# EAGLE design ConstantCurrentTester (EAGLE 9.5.2)
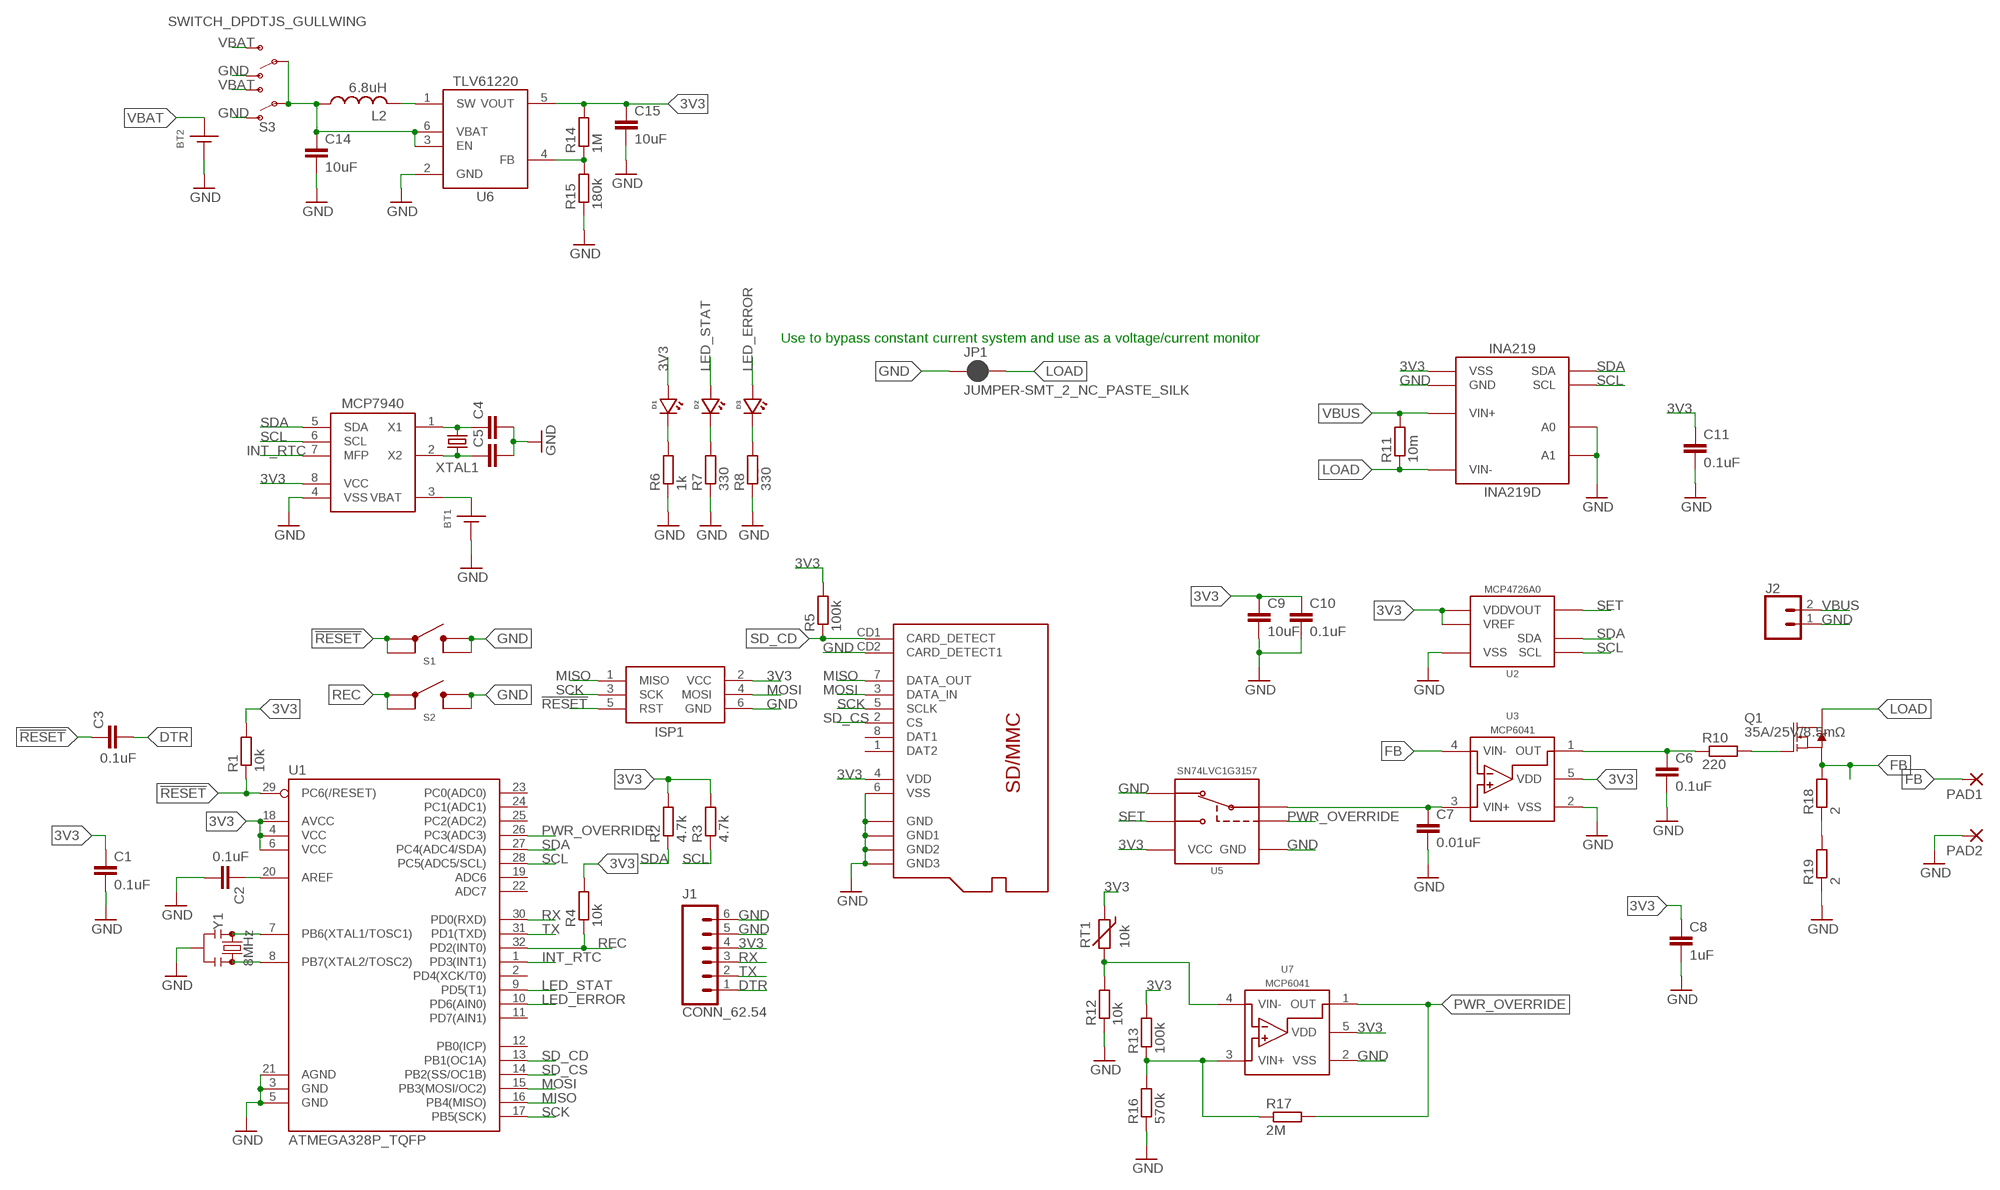
[diagram p0: schematic, sheet 1]

## Parts
BT1  BATTERY_COIN12MM  [LINX_BAT-HLD-012-SMT]
BT2  BATTERY_COINAA  [BK-53]
C1  0.1uF  C-EU0.1UFC0603  [C0603]
C2  0.1uF  C-EU0.1UFC0603  [C0603]
C3  0.1uF  C-EU0.1UFC0603  [C0603]
C4  C-EUC0603  [C0603]
C5  C-EUC0603  [C0603]
C6  0.1uF  C-EU0.1UFC0603  [C0603]
C7  0.01uF  C-EUC0603  [C0603]
C8  1uF  C-EU1UFC0603  [C0603]
C9  10uF  C-EU10UFC0805  [C0805]
C10  0.1uF  C-EU0.1UFC0603  [C0603]
C11  0.1uF  C-EU0.1UFC0603  [C0603]
C14  10uF  C-EU10UFC0805  [C0805]
C15  10uF  C-EU10UFC0805  [C0805]
D1  LEDBLUE0603  [LED_0603]
D2  LEDGREEN0603  [LED_0603]
D3  LEDRED0603  [LED_0603]
ISP1  AVRISP-6  [AVRISP]
J1  CONN_62.54  [1X06]
J2  CONN_023.5MM  [SCREWTERMINAL-3.5MM-2]
JP1  JUMPER-SMT_2_NC_PASTE_SILK  [SMT-JUMPER_2_NC_PASTE_SILK]
L2  6.8uH  INDUCTOR1008  [1008]
PAD1  3,81/1,4  [3,81/1,4]
PAD2  3,81/1,4  [3,81/1,4]
Q1  35A/25V/8.5mΩ  MOSFET-NCH-FDD8780  [DPAK]
R1  10k  R-EU_10KR0603  [R0603]
R2  4.7k  R-EU_4.7KR0603  [R0603]
R3  4.7k  R-EU_4.7KR0603  [R0603]
R4  10k  R-EU_10KR0603  [R0603]
R5  100k  R-EU_100KR0603  [R0603]
R6  1k  R-EU_1KR0603  [R0603]
R7  330  R-EU_330R0603  [R0603]
R8  330  R-EU_330R0603  [R0603]
R10  220  R-EU_220R0603  [R0603]
R11  10m  R-EU_0.01R0805  [R0805]
R12  10k  R-EU_10KR0603  [R0603]
R13  100k  R-EU_100KR0603  [R0603]
R14  1M  R-EU_1MR0603  [R0603]
R15  180k  R-EU_180KR0603  [R0603]
R16  570k  R-EU_R0603  [R0603]
R17  2M  R-EU_R0603  [R0603]
R18  2  R-EU_R2512  [R2512]
R19  2  R-EU_R2512  [R2512]
RT1  10k  THERMISTOR10K  [R0603]
S1  BUTTON6X6_TH  [SWITCH_6MM_TH]
S2  BUTTON6X6_TH  [SWITCH_6MM_TH]
S3  SWITCH_DPDTJS_GULLWING  [JS202011SCQN]
U1  ATMEGA328P_TQFP  ATMEGA328PTQFP_32  [TQFP32-08]
U2  MCP4726A0SOT-23  [SOT23-6L]
U3  MCP6041  [SOT23-5]
U4  INA219D  [SOIC_8]
U5  SN74LVC1G3157SC70  [DCK_R-PDSO-G6]
U6  TLV61220DBV  [DBV_R-PDSO-G6]
U7  MCP6041  [SOT23-5]
U$1  MICRO_SD  [CUSTOM-PARTS_SD_MICRO]
U$2  MCP7940SOIC  [SO08]
XTAL1  CRYSTAL3.2X1.5  [CRYSTAL_3.2X1.5_2-SMD]
Y1  8MHz  RESONATOR8MHZSMD_3.2X1.3  [RESONATOR-SMD-3.2X1.3]

## Nets
3V3: C1.1 C8.1 C9.1 C10.1 C11.1 C15.1 D1.ANODE ISP1.2(VCC) J1.4 R1.2 R2.2 R3.2 R4.2 R5.2 R13.2 R14.2 RT1.1 U1.4(VCC) U1.6(VCC) U1.18(AVCC) U2.3(VDD) U2.6(VREF) U3.5(VDD) U4.5(VSS) U5.5(VCC) U6.5(VOUT) U7.5(VDD) U$1.4(VDD) U$2.8(VCC)
!RESET: C3.1 ISP1.5(RST) R1.1 S1.1 S1.2 U1.29(PC6(/RESET))
DRIVE: Q1.1(G) R10.2
DTR: C3.2 J1.1
FB: PAD1.1(P) Q1.3(S) R18.2 U3.4(VIN-)
FB2: R14.1 R15.2 U6.4(FB)
GND: BT1.GND(-) BT2.NEG@1(-) BT2.NEG@2(-) C1.2 C2.2 C4.2 C5.2 C6.2 C7.2 C8.2 C9.2 C10.2 C11.2 C14.2 C15.2 ISP1.6(GND) J1.5 J1.6 J2.1 JP1.1 PAD2.1(P) R6.1 R7.1 R8.1 R12.1 R15.1 R16.1 R19.1 S1.3 S1.4 S2.3 S2.4 S3.1(O1) S3.6(O2) U1.3(GND) U1.5(GND) U1.21(AGND) U2.2(VSS) U3.2(VSS) U4.1(A1) U4.2(A0) U4.6(GND) U5.2(GND) U5.3(B1) U6.2(GND) U7.2(VSS) U$1.6(VSS) U$1.CD2(CARD_DETECT1) U$1.GND@1(GND) U$1.GND@2(GND1) U$1.GND@3(GND2) U$1.GND@5(GND3) U$2.4(VSS) Y1.2
INT_RTC: U1.1(PD3(INT1)) U$2.7(MFP)
LED_ERROR: D3.ANODE U1.10(PD6(AIN0))
LED_STAT: D2.ANODE U1.9(PD5(T1))
LOAD: JP1.2 Q1.4(D) R11.1 U4.7(VIN-)
MISO: ISP1.1(MISO) U1.16(PB4(MISO)) U$1.7(DATA_OUT)
MOSI: ISP1.4(MOSI) U1.15(PB3(MOSI/OC2)) U$1.3(DATA_IN)
N$1: U1.7(PB6(XTAL1/TOSC1)) Y1.1
N$2: U1.8(PB7(XTAL2/TOSC2)) Y1.3
N$3: C2.1 U1.20(AREF)
N$5: C4.1 U$2.1(X1) XTAL1.P$1
N$6: C5.1 U$2.2(X2) XTAL1.P$2
N$7: D1.CATHODE R6.2
N$8: D2.CATHODE R7.2
N$9: D3.CATHODE R8.2
N$10: C6.1 R10.1 U3.1(OUT)
N$11: R12.2 RT1.2 U7.4(VIN-)
N$12: R13.1 R16.2 R17.1 U7.3(VIN+)
N$13: R18.1 R19.2
PWR_OVERRIDE: R17.2 U1.26(PC3(ADC3)) U5.6(S) U7.1(OUT)
REC: R4.1 S2.1 S2.2 U1.32(PD2(INT0))
RX: J1.3 U1.30(PD0(RXD))
SCK: ISP1.3(SCK) U1.17(PB5(SCK)) U$1.5(SCLK)
SCL: R3.1 U1.28(PC5(ADC5/SCL)) U2.5(SCL) U4.4(SCL) U$2.6(SCL)
SD_CD: R5.1 U1.13(PB1(OC1A)) U$1.CD1(CARD_DETECT)
SD_CS: U1.14(PB2(SS/OC1B)) U$1.2(CS)
SDA: R2.1 U1.27(PC4(ADC4/SDA)) U2.4(SDA) U4.3(SDA) U$2.5(SDA)
SET: C7.1 U2.1(VOUT) U3.3(VIN+) U5.1(B2) U5.4(A)
SW1: L2.2 U6.1(SW)
TX: J1.2 U1.31(PD1(TXD))
V_BACKUP: BT1.POWER0(+) BT1.POWER1(+) U$2.3(VBAT)
VBAT: BT2.POS@1(+) BT2.POS@2(+) S3.3(S1) S3.4(S2)
VBUS: J2.2 R11.2 U4.8(VIN+)
VIN: C14.1 L2.1 S3.2(P1) S3.5(P2) U6.3(EN) U6.6(VBAT)
Unconnected: U1.2(PD4(XCK/T0)) U1.11(PD7(AIN1)) U1.12(PB0(ICP)) U1.19(ADC6) U1.22(ADC7) U1.23(PC0(ADC0)) U1.24(PC1(ADC1)) U1.25(PC2(ADC2)) U$1.1(DAT2) U$1.8(DAT1)

## Notes on the sheet
- Use to bypass constant current system and use as a voltage/current monitor

## Library data of the parts
BT1 = bschulz:BATTERY_COIN: Coin Cell Battery Holder; DIGIKEY: BAT-HLD-012-SMT-ND; MF: Linx; MPN: BAT-HLD-012-SMT
BT2 = bschulz:BATTERY_COIN: Coin Cell Battery Holder
C1-C3 C6 C10 C11 = bschulz_passives:C-EU: CAPACITOR, European symbol; DIGIKEY: 490-6051-1-ND; MF: Murata; MPN: GCM188R71E104KA57D
C4 C5 C7 = bschulz_passives:C-EU: CAPACITOR, European symbol
C8 = bschulz_passives:C-EU: CAPACITOR, European symbol; DIGIKEY: 587-1251-1-ND; MF: Yaiyo Yuden; MPN: EMK107BJ105KA-T
C9 C14 C15 = bschulz_passives:C-EU: CAPACITOR, European symbol; DIGIKEY: 490-6473-6-ND; MF: Murata; MPN: GRM21BR61C106KE15K
D1 = bschulz:LED: Genaric LED; DIGIKEY: 732-4966-1-ND; MF: Wurth; MPN: 150060BS75000
D2 = bschulz:LED: Genaric LED; DIGIKEY: 732-4971-1-ND; MF: Wurth; MPN: 150060GS75000
D3 = bschulz:LED: Genaric LED; DIGIKEY: 732-4978-1-ND; MF: Wurth; MPN: 150060RS75000
ISP1 = bschulz:AVRISP: AVR ISP HEADER Standard 6 pin header for AVR programming
J1 = bschulz:CONN_6: Genaric 6 terminal header Digikey 2.54_SCREW
J2 = bschulz:CONN_02: Genaric 2 terminal header SCREW_2.54 39532_RA; DIGIKEY: ED2635-ND; MF: On Shore Technology; MPN: OSTTE020161; PROD_ID: CONN-08399
JP1 = SparkFun-Jumpers:JUMPER-SMT_2_NC_PASTE: Normally closed solder jumper This jumper has an aperture in the stencil to allow solder paste to bridge the split in the wire so it's normally closed (NC). Wick off the solder to open the connection. Reapply solder to reclose the connection.
L2 = bschulz:INDUCTOR: Genaric inductor; DIGIKEY: 732-4849-1-ND; MF: Wurth; MPN: 74438323068
PAD1 PAD2 = wirepad:3,81/1,4: THROUGH-HOLE PAD
Q1 = bschulz:MOSFET-NCH: N-channel MOSFETs Voltage controlled devices that allow control of high current outputs. SparkFun Products: SparkFun OpenScale <https://www.sparkfun.com/products/13261> SparkFun Digital Sandbox <https://www.sparkfun.com/products/12651> SparkFun Monster Moto Shield <https://www.sparkfun.com/products/10182> SparkFun MOSFET Power Controller <https://www.sparkfun.com/products/11214>; PROD_ID: TRANS-09984
R1 R4 = bschulz:R-EU_: RESISTOR, European symbol Digikey Parts: Yageo, 0402 Yageo, 0603 Panasonic, 0603 Panasonic, precision, 0603 Panasonic, 0805 Rohm, current sense Vishay, pulse proof automotive; DIGIKEY: 311-10.0KHRCT-ND; MF: Yageo; MPN: RC0603FR-0710KL; VALUE_PART: 10k
R2 R3 = bschulz_passives:R-EU_: RESISTOR, European symbol Digikey Parts: Yageo, 0402 Yageo, 0603 Panasonic, 0603 Panasonic, precision, 0603 Panasonic, 0805 Rohm, current sense Vishay, pulse proof automotive; DIGIKEY: 311-4.70KHRCT-ND; MF: Yageo; MPN: RC0603FR-074K7L; VALUE_PART: 4.7k
R5 R13 = bschulz_passives:R-EU_: RESISTOR, European symbol Digikey Parts: Yageo, 0402 Yageo, 0603 Panasonic, 0603 Panasonic, precision, 0603 Panasonic, 0805 Rohm, current sense Vishay, pulse proof automotive; DIGIKEY: RC0402FR-071ML; MF: Yageo; MPN: RC0603FR-07100KL; VALUE_PART: 100k
R6 = bschulz_passives:R-EU_: RESISTOR, European symbol Digikey Parts: Yageo, 0402 Yageo, 0603 Panasonic, 0603 Panasonic, precision, 0603 Panasonic, 0805 Rohm, current sense Vishay, pulse proof automotive; DIGIKEY: 311-1KLDCT-ND; MF: Yageo; MPN: AC0603FR-071KL; VALUE_PART: 1k
R7 R8 = bschulz_passives:R-EU_: RESISTOR, European symbol Digikey Parts: Yageo, 0402 Yageo, 0603 Panasonic, 0603 Panasonic, precision, 0603 Panasonic, 0805 Rohm, current sense Vishay, pulse proof automotive; DIGIKEY: 311-330HRCT-ND; MF: Yageo; MPN: RC0603FR-07330RL; VALUE_PART: 330
R10 = bschulz_passives:R-EU_: RESISTOR, European symbol Digikey Parts: Yageo, 0402 Yageo, 0603 Panasonic, 0603 Panasonic, precision, 0603 Panasonic, 0805 Rohm, current sense Vishay, pulse proof automotive; DIGIKEY: 311-220HRCT-ND; MF: Yageo; MPN: RC0603FR-07220RL; VALUE_PART: 220
R11 = bschulz_passives:R-EU_: RESISTOR, European symbol Digikey Parts: Yageo, 0402 Yageo, 0603 Panasonic, 0603 Panasonic, precision, 0603 Panasonic, 0805 Rohm, current sense Vishay, pulse proof automotive; DIGIKEY: CRF0805-FZ-R010ELFCT-ND; MF: Bourns; MPN: CRF0805-FZ-R010ELF
R12 = bschulz_passives:R-EU_: RESISTOR, European symbol Digikey Parts: Yageo, 0402 Yageo, 0603 Panasonic, 0603 Panasonic, precision, 0603 Panasonic, 0805 Rohm, current sense Vishay, pulse proof automotive; DIGIKEY: 311-10.0KHRCT-ND; MF: Yageo; MPN: RC0603FR-0710KL; VALUE_PART: 10k
R14 = bschulz_passives:R-EU_: RESISTOR, European symbol Digikey Parts: Yageo, 0402 Yageo, 0603 Panasonic, 0603 Panasonic, precision, 0603 Panasonic, 0805 Rohm, current sense Vishay, pulse proof automotive; DIGIKEY: P1.00MHCT-ND; MF: Panasonic; MPN: ERJ-3EKF1004V; VALUE_PART: 1M
R15 = bschulz_passives:R-EU_: RESISTOR, European symbol Digikey Parts: Yageo, 0402 Yageo, 0603 Panasonic, 0603 Panasonic, precision, 0603 Panasonic, 0805 Rohm, current sense Vishay, pulse proof automotive; DIGIKEY: P180KHCT-ND; MF: Panasonic; MPN: ERJ-3EKF1803V; VALUE_PART: 180k
R16 R17 = bschulz_passives:R-EU_: RESISTOR, European symbol Digikey Parts: Yageo, 0402 Yageo, 0603 Panasonic, 0603 Panasonic, precision, 0603 Panasonic, 0805 Rohm, current sense Vishay, pulse proof automotive; MF: Yageo
R18 R19 = bschulz_passives:R-EU_: RESISTOR, European symbol Digikey Parts: Yageo, 0402 Yageo, 0603 Panasonic, 0603 Panasonic, precision, 0603 Panasonic, 0805 Rohm, current sense Vishay, pulse proof automotive
RT1 = bschulz:THERMISTOR: Thermistor NTC Thermistors: Digikey = 490-12101-1-ND, R25 = 47K, Package = 0603 Digikey = 490-16279-1-ND, R25 = 10K, Package = 0603; DIGIKEY: P12011CT-ND; MF: Panasonic; MPN: ERT-J1VG103FA
S1 S2 = bschulz:BUTTON: Genaric SPST Pushbutton; DIGIKEY: 450-1650-ND; MF: TE Connectivity; MPN: 1825910-6
S3 = bschulz:SWITCH_DPDT: Genric DPDT Switch; DIGIKEY: 401-2002-1-ND; MF: C&K; MPN: JS202011SCQN
U1 = bschulz:ATMEGA328P: Popular 328P in QFP Storefront component: ATmega328 - TQFP (COM-13448) Datasheet SparkFun Products SparkFun RedBoard - Programmed with Arduino (DEV-12757) Arduino Pro Mini 328 - 5V/16MHz (DEV-11113) Arduino Pro Mini 328 - 3.3V/8MHz (DEV-11114) SparkFun OpenLog (DEV-13712) SparkFun MicroView - OLED Arduino Module (DEV-12923) SparkFun Digital Sandbox (DEV-12651) SparkFun PicoBoard (WIG-11888) Arduino Fio (DEV-10116) LilyPad Arduino 328 Main Board (DEV-13342) SparkFun RedStick (DEV-13741) LilyPad MP3 (DEV-11013) LilyPad Arduino SimpleSnap (DEV-10941) SparkFun Stepoko (ROB-13899) SparkFun Geiger Counter (SEN-11345) SparkFun EL Sequencer (COM-12781) Arduino Pro 328 - 5V/16MHz (DEV-10915) CryptoCape (DEV-12773) SparkFun IR Thermometer Evaluation Board - MLX90614 (SEN-10740) SparkFun RedBot Mainboard (ROB-12097) Arduino Pro 328 - 3.3V/8MHz (DEV-10914) SparkFun Block for Intel® Edison - Arduino (DEV-13036) SparkFun Simon Says - Surface Mount Soldering Kit (KIT-10935) SparkFun 7-Segment Serial Display - Red (COM-11441) SparkFun 7-Segment Serial Display - White (COM-11629) SparkFun 7-Segment Serial Display - Yellow (COM-11443) SparkFun 7-Segment Serial Display - Kelly Green (COM-11440) SparkFun 7-Segment Serial Display - Blue (COM-11442) SparkFun OpenSegment Serial Display - 20mm (Blue) (COM-11647) SparkFun OpenSegment Serial Display - 20mm (Green) (COM-11646) SparkFun OpenSegment Serial Display - 20mm (White) (COM-11648) SparkFun OpenSegment Serial Display - 20mm (Red) (COM-11644) SparkFun OpenSegment Serial Display - 20mm (Yellow) (COM-11645) SparkFun OpenSegment Shield (DEV-13190); DIGIKEY: ATMEGA328PB-AURCT-ND; MF: Atmel; MPN: ATMEGA328PB-AUR; PROD_ID: IC-09069
U2 = bschulz:MCP4726*: MCP4726x - 8/10/12 Bit Digital to Analog Converter Characteristics: VCC: 2.7~5.5V IQ: 210μA (On), 60nA (Shutdown) Operating Temperature: -40°C to 125°C Number of Outputs: 1 Settling Time: 6μs Number of Bits: 8 (MCP4706), 10 (MCP4716), 12 (MCP4726) Digikey: MCP4726A0T-E/CHCT-ND (MCP4726, A0) <https://www.digikey.com/product-detail/en/microchip-technology/MCP4726A0T-E-CH/MCP4726A0T-E-CHCT-ND/2713266> MCP4726A1T-E/CHCT-ND (MCP4726, A1) <https://www.digikey.com/product-detail/en/microchip-technology/MCP4726A1T-E-CH/MCP4726A1T-E-CHCT-ND/5148848> MCP4726A2T-E/CHCT-ND (MCP4726, A2) <https://www.digikey.com/product-detail/en/microchip-technology/MCP4726A2T-E-CH/MCP4726A2T-E-CHCT-ND/8638162> MCP4726A3T-E/CHCT-ND (MCP4726, A3) <https://www.digikey.com/product-detail/en/microchip-technology/MCP4726A3T-E-CH/MCP4726A3T-E-CHCT-ND/7065582>; DIGIKEY: MCP4726A0T-E/CHCT-ND; DISP: MCP4726A0; MF: Microchip; MPN: MCP4726A0T-E/CH
U3 U7 = bschulz:MCP6041: MCP6041 - Low Power Rail to Rail Op-Amp Characteristics: Vs: 1.4V ~ 6V Iq: 600nA Common Mode Range: 0V ~ 6V GBP: 14 kHz Operating Temperature: -40°C to 125°C Digikey: MCP6041T-I/OTCT-ND; DIGIKEY: MCP6041T-I/OTCT-ND; DISP: MCP6041; MF: Microchip; MPN: MCP6041T-I/OT
U4 = bschulz:INA219: INA219 - Zero Drift Bidirectional Current/Power Monitor with I2C Interface Characteristics: Vcc: 3V ~ 5.5V Iq: 700uA Common Mode Range: 0V ~ 26V Operating Temperature: -40°C to 125°C Digikey: SOIC (D) SOT-23 (DCN); DIGIKEY: 296-23978-1-ND; MF: TI; MPN: INA219AIDR
U5 = bschulz:SN74LVC1G3157: SN74LVC1G3157 - SPDT Analog Switch Characteristics: VCC: 1.65~5.5V Operating Temperature: -40°C to 85°C On state resistace: 15 Ω, Max Channel to Channel Matching: 0.1 Ω, Typical Digikey: 296-14909-1-ND (SC70, DCK) <https://www.digikey.com/product-detail/en/texas-instruments/SN74LVC1G3157DCKR/296-14909-1-ND/562526> 296-18015-1-ND (SOT-666, DRL) <https://www.digikey.com/product-detail/en/texas-instruments/SN74LVC1G3157DRLR/296-18015-1-ND/770530>; DIGIKEY: 296-14909-1-ND; DISP: SN74LVC1G3157; MF: TI; MPN: SN74LVC1G3157DCKR
U6 = bschulz:TLV61220: TLV61220 - Low-Input Voltage Step-Up Converter (Boost) Characteristics: Vin: 0.7V ~ 5.5V Vout: 1.8V ~ 5.5V Output Current (Max): 400 mA IQ: 5μA Operating Temperature: -40°C to 85°C Digikey: 296-30547-1-ND <https://www.digikey.com/product-detail/en/texas-instruments/TLV61220DBVR/296-30547-1-ND/3458120>; DIGIKEY: 296-30547-1-ND; MF: TI; MPN: TLV61220DBVR
U$1 = bschulz:MICRO_SD: Micro SD card holder, Push-Pull, Exposed leads for easy (non-reflow) soldering PN: HR1941CT-ND
U$2 = bschulz:MCP7940: MCP7940 - RTC Characteristics: VCC: 1.8~5.5V VBat: 1.3~5.5V Memory: 64B Interface: I2C Operating Temperature: -40°C to 85°C Digikey: MCP7940N-I/SN-ND Pin Compatible Alternatives Note: These are recomendations at the time, always verify pin compatability using combination of Mrk1 EyeBall and quality datasheet; DIGIKEY: MCP7940N-I/SN-ND; MF: Microchip; MPN: MCP7940N-I/SN
XTAL1 = bschulz:CRYSTAL: Crystal Oscilator 2 Pin quartz crystal oscilators Variants 3.2x1.5mm (Only available in 32.768kHz) <https://www.digikey.com/products/en/crystals-oscillators-resonators/crystals/171?FV=b839bf%2Cb83a33%2C8640001%2C864000f%2C8640003%2C1f140000%2Cmu32.768kHz%7C2150%2Cffe000ab&quantity=10&ColumnSort=1000011&page=1&stock=1&k=crystal&pageSize=25&pkeyword=crystal> 5 x 3.2mm (8MHz ~ 50MHz) <https://www.digikey.com/products/en/crystals-oscillators-resonators/crystals/171?FV=402f3e%2Cb8434d%2C1f140000%2Cffe000ab&quantity=10&ColumnSort=1000011&page=1&stock=1&pageSize=25>
Y1 = bschulz:RESONATOR: 16MHz Resonator Digikey Example <http://www.digikey.com/product-detail/en/murata-electronics-north-america/CSTCE16M0V53-R0/490-1198-1-ND/584635> Frequency: 16MHz Frequency Stability: ±0.3% Frequency Tolerance: ±0.5% Capacitance: 15pF SparkFun Products SparkFun OpenLog <https://www.sparkfun.com/products/13712> SparkFun MicroView - OLED Arduino Module <https://www.sparkfun.com/products/12923>; DIGIKEY: 490-17960-1-ND; MF: Murata; MPN: CSTNE8M00G55Z000R0

## Board
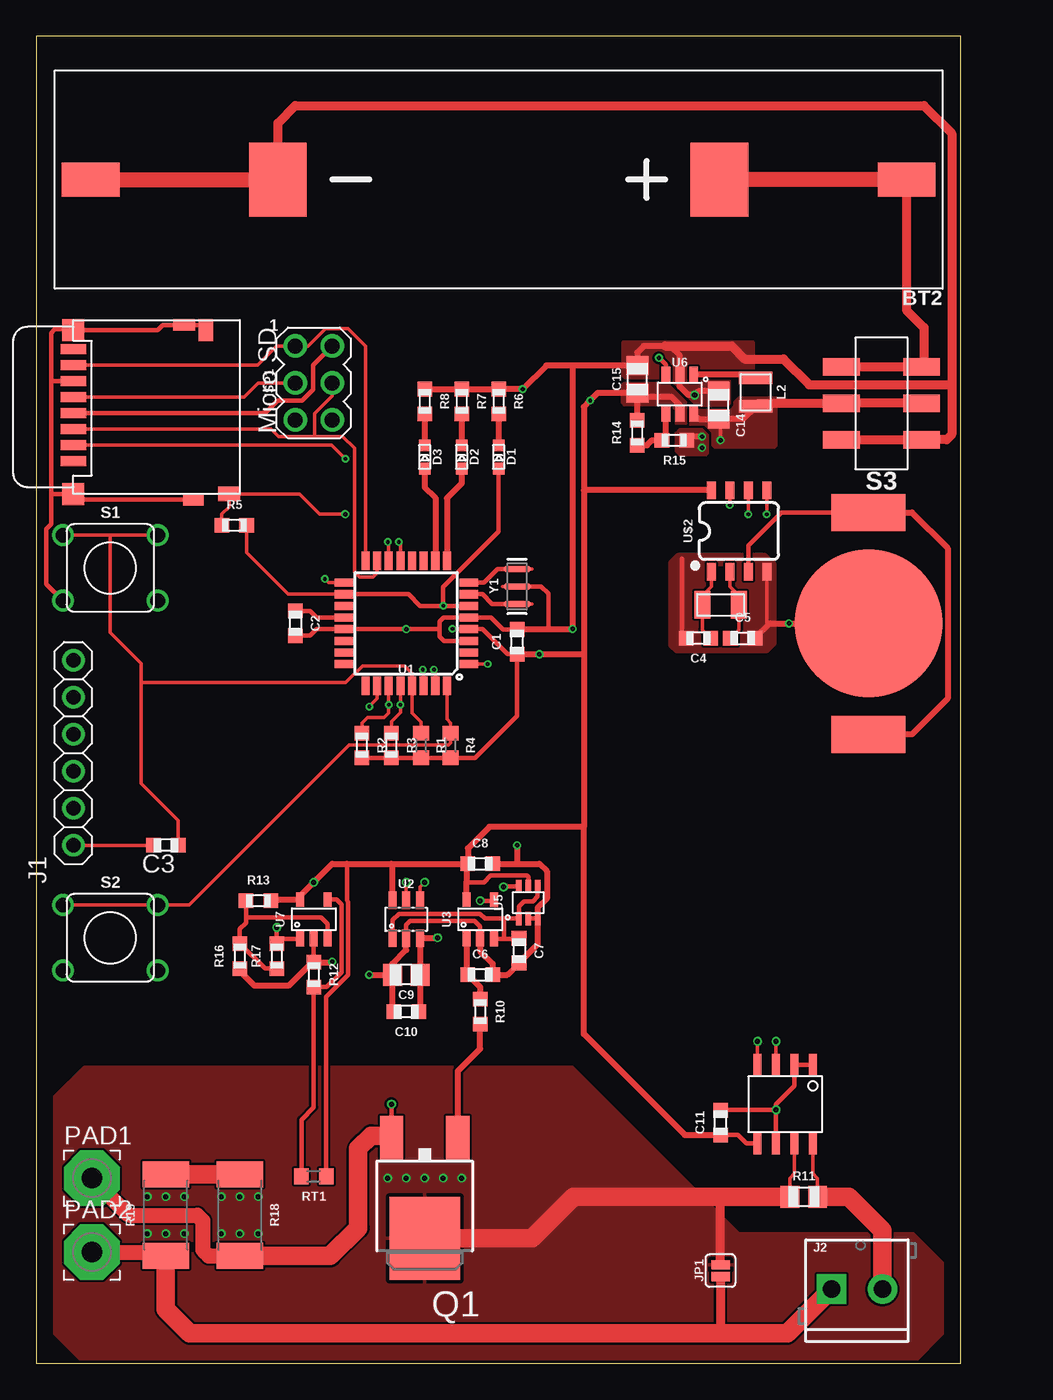
[diagram p1: board, top side]
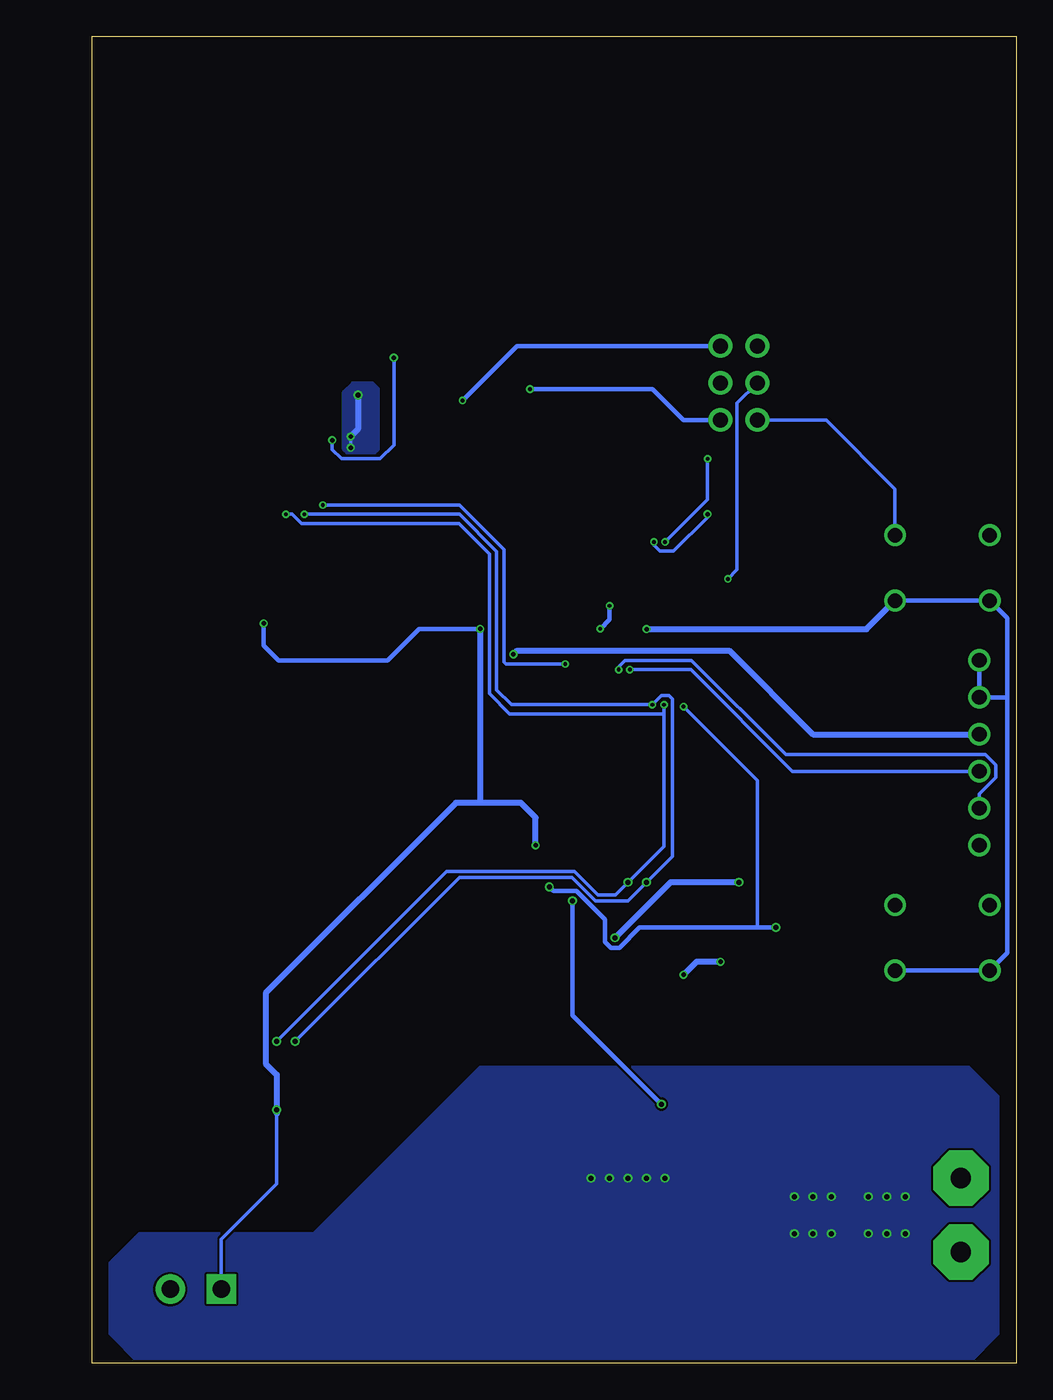
[diagram p2: board, bottom side, seen from below]

Size 63.48 x 91.11 mm. Coordinates in mm from the lower left corner, seen from the top.
Outline: 0,0 63.48,0 63.48,91.11 0,91.11 0,0
Copper layers (1*16): Top 0.035559375mm / dielectric 1.6mm / Bottom 0.035559375mm
Design rules "jlcpcb2layer *": minimum track width 5mil, minimum drill 0.2mm, track to track 6mil, track to pad 6mil, pad to pad 6mil, via to via 6mil, smd to smd 6mil, copper to edge 8mil, drill to drill 6mil, minimum pad ring 5mil, minimum via ring 5mil, stop-mask expansion 2.5mil, vias tented up to drill 0mil, thermal gap 10mil

### Footprints (pad centres in the part's own frame; a part is rotated, then mirrored left to right if it is on the bottom)
LINX_BAT-HLD-012-SMT = smd 10.16 x 10.16: GND 0,0 | smd 2.54 x 5.08: POWER0 -7.62,0; POWER1 7.62,0
BK-53 = smd 3.96 x 2.34: NEG@1 28.015,0; POS@1 -28.015,0 | smd 3.96 x 5.08: NEG@2 15.165,0; POS@2 -15.165,0
C0603 = smd 1 x 1: 1 -0.85,0; 2 0.85,0
C0805 = smd 1.3 x 1.5: 1 -0.95,0; 2 0.95,0
LED_0603 = smd 0.8 x 0.8: ANODE 0.8,0; CATHODE -0.8,0
AVRISP = drill 1.02 pad 1.626: 1 -1.27,2.54; 2 1.27,2.54; 3 -1.27,0; 4 1.27,0; 5 -1.27,-2.54; 6 1.27,-2.54
1X06 = drill 1.016: 1 -6.35,0; 2 -3.81,0; 3 -1.27,0; 4 1.27,0; 5 3.81,0; 6 6.35,0
SCREWTERMINAL-3.5MM-2 = drill 1.2 pad 2.032 square: 1 0,0 | drill 1.2 pad 2.032: 2 3.5,0
SMT-JUMPER_2_NC_PASTE_SILK = smd 0.635 x 1.27: 1 -0.406,0; 2 0.406,0
1008 = smd 0.85 x 2.3: 1 -0.975,0; 2 0.975,0
3,81/1,4 = drill 1.397 pad 3.81 octagon: 1 0,0
DPAK = smd 1.6 x 3: 1 -2.28,-5.31; 3 2.28,-5.31 | smd 4.826 x 5.715: 4 0,1.588
R0603 = smd 1 x 1.1: 1 -0.85,0; 2 0.85,0
R0603' = smd 1 x 1: 1 -0.85,0; 2 0.85,0
R0805 = smd 1.3 x 1.5: 1 -0.95,0; 2 0.95,0
R2512 = smd 1.8 x 3.2: 1 -2.8,0; 2 2.8,0
SWITCH_6MM_TH = drill 1: 1 -3.25,2.25; 2 3.25,2.25; 3 -3.25,-2.25; 4 3.25,-2.25
JS202011SCQN = smd 1.2 x 2.515: 1 -2.5,-2.75; 2 0,-2.75; 3 2.5,-2.75; 4 2.5,2.75; 5 0,2.75; 6 -2.5,2.75
TQFP32-08 = smd 1.27 x 0.559: 1 -4.293,2.8; 2 -4.293,2; 3 -4.293,1.2; 4 -4.293,0.4; 5 -4.293,-0.4; 6 -4.293,-1.2; 7 -4.293,-2; 8 -4.293,-2.8; 17 4.293,-2.8; 18 4.293,-2; 19 4.293,-1.2; 20 4.293,-0.4; 21 4.293,0.4; 22 4.293,1.2; 23 4.293,2; 24 4.293,2.8 | smd 0.559 x 1.27: 9 -2.8,-4.293; 10 -2,-4.293; 11 -1.2,-4.293; 12 -0.4,-4.293; 13 0.4,-4.293; 14 1.2,-4.293; 15 2,-4.293; 16 2.8,-4.293; 25 2.8,4.293; 26 2,4.293; 27 1.2,4.293; 28 0.4,4.293; 29 -0.4,4.293; 30 -1.2,4.293; 31 -2,4.293; 32 -2.8,4.293
SOT23-6L = smd 0.55 x 1.2: 1 -0.95,-1.3; 2 0,-1.3; 3 0.95,-1.3; 4 0.95,1.3; 5 0,1.3; 6 -0.95,1.3
SOT23-5 = smd 0.55 x 1: 1 -0.95,-1.35; 2 0,-1.35; 3 0.95,-1.35; 4 0.95,1.35; 5 -0.95,1.35
SOIC_8 = smd 0.55 x 1.5: 1 -2.54,-2.7; 2 -1.27,-2.7; 3 0,-2.7; 4 1.27,-2.7; 5 1.27,2.7; 6 0,2.7; 7 -1.27,2.7; 8 -2.54,2.7
DCK_R-PDSO-G6 = smd 0.4 x 0.9: 1 -0.65,-1.1; 2 0,-1.1; 3 0.65,-1.1; 4 0.65,1.1; 5 0,1.1; 6 -0.65,1.1
DBV_R-PDSO-G6 = smd 0.6 x 1.05: 1 -0.95,-1.35; 2 0,-1.35; 3 0.95,-1.35; 4 0.95,1.35; 5 0,1.35; 6 -0.95,1.35
CUSTOM-PARTS_SD_MICRO = smd 0.7 x 1.75: 1 -2.25,0; 2 -3.35,0; 3 -4.45,0; 4 -5.55,0; 5 -6.65,0; 6 -7.75,0; 7 -8.85,0; 8 -9.95,0 | smd 1 x 1.5: CD1 0,10.7 | smd 1.5 x 1: CD2 -11.25,9.1 | smd 1.5 x 1.5: GND@1 0,0; GND@2 -11.25,0 | smd 0.8 x 1.5: GND@3 -11.6,7.6 | smd 0.8 x 1.4: GND@5 0.4,8.25
SO08 = smd 0.6 x 1.2: 1 -1.905,-2.8; 2 -0.635,-2.8; 3 0.635,-2.8; 4 1.905,-2.8; 5 1.905,2.8; 6 0.635,2.8; 7 -0.635,2.8; 8 -1.905,2.8
CRYSTAL_3.2X1.5_2-SMD = smd 1.1 x 1.9: P$1 -1.25,0; P$2 1.25,0
RESONATOR-SMD-3.2X1.3 = smd 0.45 x 1.905: 1 -1.2,0; 2 0,0; 3 1.2,0

### Placement (x,y rotation side)
BT1  57.15,50.8 90 top
BT2  31.75,81.28 180 top
C1  33.02,49.53 90 top
C2  17.78,50.8 270 top
C3  8.89,35.56 180 top
C4  45.47,49.78 180 top
C5  48.51,49.78 0 top
C6  30.48,26.67 0 top
C7  33.15,28.32 270 top
C8  30.48,34.29 0 top
C9  25.4,26.67 180 top
C10  25.4,24.13 180 top
C11  46.99,16.51 90 top
C14  46.86,65.79 90 top
C15  41.27,67.56 90 top
D1  31.75,62.23 270 top
D2  29.21,62.23 270 top
D3  26.67,62.23 270 top
ISP1  19.05,67.31 0 top
J1  2.54,41.91 90 top
J2  54.61,5.08 0 top
JP1  46.99,6.35 90 top
L2  49.4,66.67 90 top
PAD1  3.81,12.7 0 top
PAD2  3.81,7.62 0 top
Q1  26.67,10.16 180 top
R1  26.42,42.42 270 top
R2  4.7k  [R0603']  22.35,42.42 270 top
R3  4.7k  [R0603']  24.38,42.42 270 top
R4  28.45,42.42 270 top
R5  100k  [R0603']  13.59,57.53 0 top
R6  1k  [R0603']  31.75,66.04 270 top
R7  330  [R0603']  29.21,66.04 270 top
R8  330  [R0603']  26.67,66.04 270 top
R10  220  [R0603']  30.48,24.13 270 top
R11  52.7,11.43 0 top
R12  10k  [R0603']  19.05,26.67 270 top
R13  100k  [R0603']  15.24,31.75 0 top
R14  1M  [R0603']  41.27,63.88 90 top
R15  180k  [R0603']  43.81,63.37 180 top
R16  570k  [R0603']  13.97,27.94 90 top
R17  2M  [R0603']  16.51,27.94 90 top
R18  13.97,10.16 270 top
R19  8.89,10.16 90 top
RT1  19.05,12.83 180 top
S1  5.08,54.61 0 top
S2  5.08,29.21 0 top
S3  58.04,65.91 90 top
U1  25.4,50.8 180 top
U2  25.4,30.48 0 top
U3  30.48,30.48 0 top
U4  50.8,17.78 180 top
U5  33.78,31.62 0 top
U6  44.2,66.55 180 top
U7  19.05,30.48 0 top
U$1  2.54,59.69 270 top
U$2  48.26,57.15 0 top
XTAL1  46.99,52.07 0 top
Y1  33.02,53.34 90 top

### Tracks (layer width: path | path; a pad name or v marks a point on that pad's centre or on a via)
3V3  (via drill 0.25 pad 0.13, 0.3 pad 0.13, 0.35)
  Top 0.254: R5.2 14.44,55.66 17.3,52.8 U1.18 | 37.59,48.64 37.55,48.68
  Top 0.305: C11.1 48.19,15.66 48.77,15.08 U4.5 | 29.53,33.02 30.73,33.02 31.2,33.48 33.7,33.48 33.78,33.4 U5.5 | RT1.1 19.9,25.13 21.41,26.65 21.41,31.68 21.34,31.76 21.34,34.29 | R2.2 R3.2 R1.2 R4.2 30.14,41.57 33.02,44.45 C1.1 32.89,48.68 32.35,48.68 30.63,50.4 U1.4 28.59,50.4 v28.57,50.42 | U1.18 25.56,52.8 26.36,52 v27.94,52 | v27.94,52 U1.6 | U$1.4 15.71,65.24 16.56,66.09 18.23,66.09 19,66.86 19,68.53 ISP1.2 | v27.94,52 27.94,53.28 31.75,57.09 D1.ANODE
  Top 0.406: U6.5 44.2,65.79 43.62,66.36 41.53,66.36 C15.1 | R14.2 C15.1 | C15.1 38.55,66.61 v38.04,66.1 37.59,65.66 37.59,59.94 | C10.1 26.35,24.23 C9.1 U2.3 27.53,29.18 v27.56,29.21 | C8.1 29.53,34.19 29.53,33.02 U3.5 | R13.2 16.17,31.83 U7.5 18.1,32.07 v19.05,33.02 20.32,34.29 21.34,34.29 24.38,34.29 | 24.38,34.29 C8.1 | U2.6 24.45,34.22 24.38,34.29 | C11.1 44.54,15.66 37.59,22.61 37.59,36.83 | 37.59,59.94 37.59,48.64 37.59,36.83 | 37.59,36.83 31.11,36.83 29.63,35.34 C8.1 | 32.89,48.68 v34.54,48.68 37.55,48.68 | U$2.8 37.59,59.94
  Bottom 0.305: v28.57,50.42 27.94,51.05 v27.94,52 | ISP1.2 34.29,69.85 v38.04,66.1
  Bottom 0.406: v19.05,33.02 23.75,33.02 v27.56,29.21 | J1.4 13.97,43.18 19.72,48.93 34.29,48.93 v34.54,48.68
  pour Top (rank 2, no thermals): 40.26,67.18 40.39,67.31 43.43,67.31 44.58,66.17 44.58,64.52 43.94,64.52 43.94,65.41 43.56,65.79 40.39,65.79 40.26,65.91
!RESET
  Top 0.254: R1.1 26.42,44.03 25.8,44.65 U1.29 25.8,47.35 25.27,47.88 22.39,47.88 21.24,46.74 7.2,46.74 | S1.1 5.08,56.86 | 5.08,56.86 S1.2 | 7.2,46.74 7.2,46.99 7.2,48.05 5.08,50.16 5.08,56.86 | 7.2,46.74 7.2,39.79 9.74,37.25 C3.1
  Bottom 0.254: S1.2 8.33,60.03 13.06,64.77 ISP1.5
DRIVE
  Top 0.406: Q1.1 28.95,20.06 30.48,21.59 R10.2
DTR
  Top 0.254: C3.2 J1.1
FB  (via drill 0.35)
  Top 0.305: U3.4 31.35,31.75 v30.48,31.75 | v24.38,17.78 v24.39,17.77 24.39,15.62 Q1.3
  Top 1.016: PAD1.1 6.35,10.16 11.05,10.16 11.43,9.78 11.43,7.75 11.82,7.36 R18.2 12.96,7.36
  Top 1.27: R18.2 20.19,7.36 22.1,9.27 22.1,14.73 22.99,15.62 24.39,15.62
  Bottom 0.305: v30.48,31.75 30.48,23.88 v24.38,17.78
FB2
  Top 0.406: R14.1 41.95,63.03 42.29,63.37 R15.2 43.25,63.65 U6.4
GND  (via drill 0.3, 0.3 pad 0.13, 0.35)
  Top 0.254: C5.2 50.16,50.59 U$2.4
  Top 0.305: U5.2 U5.3 | U2.2 25.4,30.1 25.65,30.35 30.1,30.35 30.48,29.97 U3.2 | R12.1 U7.2 | U4.6 v50.8,17.4 | v50.8,17.4 50.8,17.75 52.07,19.02 U4.2 U4.1 | C11.2 47.03,17.4 v50.8,17.4 | C1.2 32.04,50.38 31.22,51.2 U1.5 27.96,51.2 27.69,50.93 27.69,50.42 | Y1.2 34.67,53.34 35.18,52.83 35.18,50.38 | 27.69,50.42 27.69,49.91 28,49.6 U1.3 | 27.69,50.42 27.67,50.4 v25.4,50.4 U1.21 19.25,50.4 18.8,49.95 C2.2 | 1.39,67.44 U$1.6 1.02,67.44 | U$1.CD2 11.29,71.29 U$1.GND@3 8.68,71.29 8.33,70.94 U$1.GND@2 2.49,70.99 1.27,70.99 1.02,70.74 1.02,67.44 | U$1.GND@5 2.94,59.29 U$1.GND@1 1.02,59.69 | S1.3 0.67,53.52 0.67,57.29 1.02,57.63 1.02,59.69 | 1.02,67.44 1.02,59.69 | C4.2 44.32,50.08 44.32,55.24
  Top 0.406: C14.2 45.47,66.74 v45.21,66.48 44.77,66.48 44.2,67.06 U6.2 44.2,69.22 43.56,69.85 43.18,69.85 41.72,69.85 41.27,69.4 C15.2 36.83,68.51 | v45.72,63.63 44.92,63.63 R15.1 | U3.2 30.48,28.28 31.33,27.43 C6.2 32.35,26.67 C7.2 34.43,28.76 U5.3 34.43,31.29 35.05,31.91 35.05,33.78 34.54,34.29 33.02,34.29 | C10.2 24.45,24.23 C9.2 | U2.2 25.4,28.37 24.45,27.42 C9.2 | C8.2 33.02,34.29 | R16.1 13.97,26.92 14.99,25.91 17.31,25.91 18.92,27.52 R12.1 20.28,27.52 v20.32,27.56 | 36.83,68.51 35.02,68.51 v33.4,66.89 R6.1 R7.1 R8.1 | C1.2 35.18,50.38 36.79,50.38 v36.83,50.42 36.83,68.51 | v33.02,35.56 33.02,34.29 | v22.86,26.67 C9.2 | C5.2 50.38,50.8 v51.69,50.8 BT1.GND
  Top 0.61: JP1.1 46.99,2.03 | S3.6 S3.1 62.52,63.41 62.87,63.75 62.87,67.18 | 43.18,69.85 47.75,69.85 48.64,68.96 51.31,68.96 53.09,67.18 62.87,67.18 | BT2.NEG@2 16.59,85.17 17.78,86.36 60.96,86.36 62.87,84.45 62.87,67.18
  Top 1.016: BT2.NEG@1 BT2.NEG@2 17.78,81.28 | PAD2.1 8.63,7.62 R19.1
  Top 1.27: R19.1 8.89,3.68 10.54,2.03 46.99,2.03 51.56,2.03 J2.1
  Bottom 0.203: v45.72,63.63 v45.72,62.87
  Bottom 0.254: v50.8,17.4 50.8,17.14 50.8,12.32 54.61,8.51 J2.1
  Bottom 0.305: 0.64,45.72 0.64,51.16 S1.3 S1.4 | 0.64,45.72 0.64,28.16 S2.3 S2.4 | J1.6 J1.5 0.64,45.72 | ISP1.6 22.86,64.77 24.98,66.89 v33.4,66.89 | v36.83,50.42 41.02,50.42 43.18,48.26 50.67,48.26 51.69,49.28 v51.69,50.8
  Bottom 0.406: v45.21,66.48 45.21,64.14 v45.72,63.63 | v25.4,50.4 10.29,50.4 S1.4 | v20.32,27.56 21.97,27.56 v22.86,26.67 | 50.8,17.14 50.8,19.81 51.56,20.57 51.56,25.41 38.49,38.48 36.7,38.48 | v33.02,35.56 33.02,37.47 34.04,38.48 36.7,38.48 | 36.7,38.48 36.83,38.61 v36.83,50.42
  pour Top (no thermals): 40.26,70.1 40.26,67.82 40.39,67.69 43.43,67.69 45.34,65.79 47.5,65.79 47.62,65.91 47.62,67.44 48.26,68.07 49.28,68.07 49.28,70.1
  pour Top (no thermals): 43.94,63.88 44.2,64.14 45.72,64.14 46.1,63.75 46.1,62.48 45.97,62.36 44.2,62.36 43.94,62.61
  pour Bottom: 46.23,62.74 45.97,62.48 44.07,62.48 43.81,62.74 43.81,66.93 44.2,67.31 45.59,67.31 46.23,66.67
  pour Top (no thermals): 43.56,54.99 43.56,49.28 43.94,48.9 50.16,48.9 50.67,49.4 50.67,54.86 50.04,55.5 48.77,55.5 48.26,54.99 48.26,51.69 48.01,51.44 46.23,51.44 46.1,51.56 46.1,54.99 45.59,55.5 44.07,55.5
  pour Top (no thermals): 45.34,55.5 49.28,55.5 49.4,55.37 49.53,55.24 49.53,53.21 47.88,53.21 47.75,53.34 47.75,53.59 47.62,53.72 47.62,54.61 47.37,54.86 47.24,54.86 46.1,54.86 45.34,54.86
INT_RTC  (via drill 0.25 pad 0.13)
  Top 0.254: U1.1 v30.98,48 v30.99,48.01 | v47.62,58.93 U$2.7
  Bottom 0.254: v30.99,48.01 35.05,48.01 35.18,48.13 35.18,55.88 38.23,58.93 v47.62,58.93
LED_ERROR
  Top 0.406: D3.ANODE 26.67,60.16 27.4,59.43 U1.10
LED_STAT
  Top 0.406: D2.ANODE 29.21,60.41 28.2,59.4 U1.9
LOAD  (via drill 0.35 pad 0.13)
  Top 0.254: U4.7 52.07,13.02 51.76,12.7 R11.1
  Top 0.61: JP1.2 46.99,11.43
  Top 1.27: R11.1 46.99,11.43 36.89,11.43 34.04,8.57 Q1.4
  other vias: 7.62,11.43 8.89,11.43 10.16,11.43 12.7,11.43 13.97,11.43 15.24,11.43 12.7,8.89 13.97,8.89 15.24,8.89 7.62,8.89 8.89,8.89 10.16,8.89 24.13,12.7 25.4,12.7 26.67,12.7 27.94,12.7 29.21,12.7
  pour Bottom: 3.81,20.32 3.27,20.32 1.27,18.32 1.27,2 3.27,0 60.23,0 62.23,2 62.23,6.89 60.23,8.89 48.26,8.89 36.83,20.32
  pour Top: 1.27,16.51 1.27,18.32 3.27,20.32 36.83,20.32 40.64,16.51 48.26,8.89 57.15,8.89 60.23,8.89 62.23,6.89 62.23,2 60.23,0 3.27,0 1.27,2
MISO
  Top 0.254: U$1.7 15.2,68.54 16.51,69.85 ISP1.1 18.67,69.85 19.86,71.04 21.41,71.04 22.6,69.86 U1.16
MOSI
  Top 0.254: U1.15 23.4,54.26 23.11,53.98 22.19,53.98 21.84,54.32 21.84,62.82 21.04,63.63 19.05,63.63 | U$1.3 16.12,64.14 16.64,63.63 19.05,63.63 | ISP1.4 20.32,66.42 19.1,65.2 19.1,63.68 19.05,63.63
N$1
  Top 0.305: Y1.1 31.3,52.14 30.64,52.8 U1.7
N$2
  Top 0.305: Y1.3 31.68,54.54 30.74,53.6 U1.8
N$3
  Top 0.254: 21.09,51.22 U1.20
  Top 0.305: U1.20 19.25,51.2 18.8,51.65 C2.1
N$5
  Top 0.254: U$2.1 46.35,53.32 45.74,52.7 XTAL1.P$1 45.74,50.36 C4.1
N$6
  Top 0.254: U$2.2 47.62,53.32 48.24,52.7 XTAL1.P$2 48.24,50.36 C5.1
N$7
  Top 0.406: R6.2 D1.CATHODE
N$8
  Top 0.406: R7.2 D2.CATHODE
N$9
  Top 0.406: R8.2 D3.CATHODE
N$10
  Top 0.406: U3.1 29.53,26.77 C6.1 30.48,25.82 R10.1
N$11
  Top 0.305: U7.4 20.62,31.83 20.95,31.5 20.95,26.84 19.94,25.82 R12.2 19.05,17.57 18.2,16.71 RT1.2
N$12
  Top 0.305: 14.39,30.61 14.39,30.23 13.97,29.81 R16.2 14.01,28.79 15.71,27.09 R17.1 | 14.39,30.61 R13.1 | U7.3 20,30.16 19.56,30.61 14.39,30.61
N$13
  Top 1.27: R18.1 R19.2
PWR_OVERRIDE  (via drill 0.25 pad 0.13, 0.35)
  Top 0.254: v22.86,45.09 23.4,45.62 U1.26
  Top 0.305: U7.1 16.85,29.13 R17.2 v16.51,29.92 | U5.6 32.09,32.72 v32.08,32.71
  Bottom 0.254: 17.78,29.92 17.78,40.01 v22.86,45.09
  Bottom 0.305: v32.08,32.71 31.8,32.43 30.2,32.43 28.24,30.48 28.24,28.93 27.84,28.53 27.28,28.53 25.88,29.92 17.78,29.92 v16.51,29.92
REC
  Top 0.254: U1.32 28.2,44.22 28.45,43.97 R4.1 28.45,42.58 28.32,42.45 21.49,42.45 10.5,31.46 S2.2 S2.1
RX  (via drill 0.25 pad 0.13)
  Top 0.254: v26.54,47.62 26.6,47.57 U1.30
  Bottom 0.254: J1.3 15.37,40.64 22.35,47.62 v26.54,47.62
SCK  (via drill 0.25 pad 0.13)
  Top 0.254: U$1.5 14.27,66.34 15.24,67.31 ISP1.3 | U1.17 20.06,53.6 v19.81,53.85
  Bottom 0.254: v19.81,53.85 19.18,54.48 19.18,65.91 ISP1.3
SCL  (via drill 0.25 pad 0.13, 0.35)
  Top 0.254: U2.5 v25.4,33.02 | U4.4 v49.53,22.1 | R3.1 24.38,44.07 25,44.69 v25,45.21 U1.28 | v48.9,58.29 U$2.6
  Bottom 0.254: v49.53,22.1 38.26,33.37 30.52,33.37 28.9,31.75 26.67,31.75 v25.4,33.02 23.62,34.8 23.62,45.59 23.88,45.85 24.36,45.85 v25,45.21 34.67,45.21 35.69,46.23 35.69,55.72 38.26,58.29 v48.9,58.29
SD_CD  (via drill 0.25 pad 0.13, 0.3 pad 0.13)
  Top 0.254: U1.13 25,56.28 v24.89,56.39 | 13.28,59.73 U$1.CD1 | R5.1 12.74,58.3 13.24,58.8 U$1.CD1 | v21.21,58.29 19.46,58.29 18.07,59.69 U$1.CD1
  Bottom 0.254: v21.21,58.29 21.21,58.08 23.54,55.75 24.47,55.75 24.89,56.18 v24.89,56.39
SD_CS  (via drill 0.25 pad 0.13)
  Top 0.254: U$1.2 20.27,63.04 v21.21,62.1 | v24.13,56.39 24.2,56.32 U1.14
  Bottom 0.254: v21.21,62.1 21.21,59.31 v24.13,56.39
SDA  (via drill 0.25 pad 0.13, 0.35)
  Top 0.254: U2.4 26.35,32.7 v26.67,33.02 | U4.3 v50.8,22.1 | R2.1 22.35,43.94 22.73,44.32 23.88,44.32 24.2,44.65 v24.2,45.21 U1.27 | v50.16,58.29 U$2.5
  Bottom 0.254: v50.8,22.1 39.12,33.77 30.35,33.77 28.73,32.16 27.53,32.16 v26.67,33.02 24.2,35.49 24.2,44.58 | 24.2,44.58 v24.2,45.21 | 24.2,44.58 34.8,44.58 36.2,45.97 36.2,55.56 38.29,57.66 49.1,57.66 49.74,58.29 v50.16,58.29
SET
  Top 0.305: U5.4 34.43,32.04 34.11,31.71 33.49,31.71 33.13,31.35 U5.1 32.13,30.52 | U2.1 24.45,30.42 24.89,30.86 30.48,30.86 30.82,30.52 32.13,30.52 | U3.3 32.13,29.13 | 32.13,29.13 33.11,29.13 C7.1 | 32.13,30.52 32.13,29.13
SW1
  Top 0.406: L2.2 49.16,67.9 U6.1
TX  (via drill 0.25 pad 0.13)
  Top 0.254: v27.3,47.62 27.4,47.53 U1.31
  Bottom 0.254: J1.2 2.54,39.08 1.4,40.22 1.4,41.06 2.12,41.78 15.84,41.78 22.32,48.26 26.88,48.26 27.3,47.84 v27.3,47.62
V_BACKUP
  Top 0.305: U$2.3 48.9,56.13 51.18,58.42 BT1.POWER1
  Top 0.406: BT1.POWER1 60.14,58.42 62.59,55.97 62.59,45.63 60.14,43.18 BT1.POWER0
VBAT
  Top 0.61: S3.4 S3.3 60.96,68.58 60.96,71.12 59.77,72.31 BT2.POS@1
  Top 1.016: BT2.POS@1 BT2.POS@2
VBUS
  Top 0.254: U4.8 53.34,13.02 53.66,12.7 R11.2
  Top 1.27: J2.2 58.11,9.13 55.81,11.43 R11.2
VIN  (via drill 0.3)
  Top 0.254: v46.99,63.37 46.99,64.71 C14.1
  Top 0.305: U6.3 43.25,68.56 v42.76,69.05
  Top 0.406: U6.6 45.51,64.84 C14.1 48.54,64.84 L2.1 50.42,65.7
  Top 0.61: L2.1 49.62,65.91 S3.5 S3.2
  Bottom 0.254: v42.76,69.05 42.76,63.03 43.69,62.1 46.35,62.1 46.99,62.74 v46.99,63.37
  pour Top (rank 3, no thermals): 44.83,65.79 45.47,65.79 45.72,65.53 47.5,65.53 48.26,66.29 50.8,66.29 50.8,62.99 50.67,62.87 46.61,62.87 46.35,63.12 46.35,63.5 45.72,64.14 44.96,64.14 44.83,64.26

### Text on the board
tDocu: RESET | GND | GND | 3v3 | RX | TX | DTR | REC | Project Bast / Bobby Schulz / 01/28/2020 / v0.0 | FB | - | + | Solar | GND